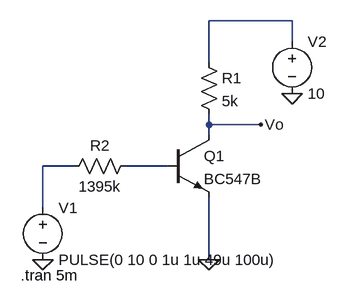
[diagram p0: schematic Lab3.4.asc]
Lab3.4.asc, the LTspice schematic file:
Version 4
SHEET 1 1032 680
WIRE 368 -80 240 -80
WIRE 368 -48 368 -80
WIRE 240 -16 240 -80
WIRE 240 80 240 64
WIRE 320 80 240 80
WIRE 240 96 240 80
WIRE 32 144 -16 144
WIRE 176 144 112 144
WIRE -16 208 -16 144
WIRE 240 288 240 192
FLAG 368 32 0
FLAG -16 288 0
FLAG 240 288 0
FLAG 320 80 Vo
SYMBOL npn 176 96 R0
SYMATTR InstName Q1
SYMATTR Value BC547B
SYMBOL res 224 -32 R0
SYMATTR InstName R1
SYMATTR Value 5k
SYMBOL voltage -16 192 R0
WINDOW 123 0 0 Left 0
WINDOW 39 0 0 Left 0
SYMATTR InstName V1
SYMATTR Value PULSE(0 10 0 1u 1u 49u 100u)
SYMBOL voltage 368 -64 R0
WINDOW 123 0 0 Left 0
WINDOW 39 0 0 Left 0
SYMATTR InstName V2
SYMATTR Value 10
SYMBOL res 128 128 R90
WINDOW 0 0 56 VBottom 2
WINDOW 3 32 56 VTop 2
SYMATTR InstName R2
SYMATTR Value 1395k
TEXT -50 312 Left 2 !.tran 5m

The netlist it stands for:
* Lab3.4.asc
Q1 Vo N003 0 0 BC547B
R1 N001 Vo 5k
V1 N002 0 PULSE(0 10 0 1u 1u 49u 100u)
V2 N001 0 10
R2 N003 N002 1395k
.model NPN NPN
.model PNP PNP
.lib standard.bjt
.tran 5m
.backanno
.end